# EAGLE design Main_board (EAGLE 7.2.0)

## Sheet 1 of 6: Stepstick
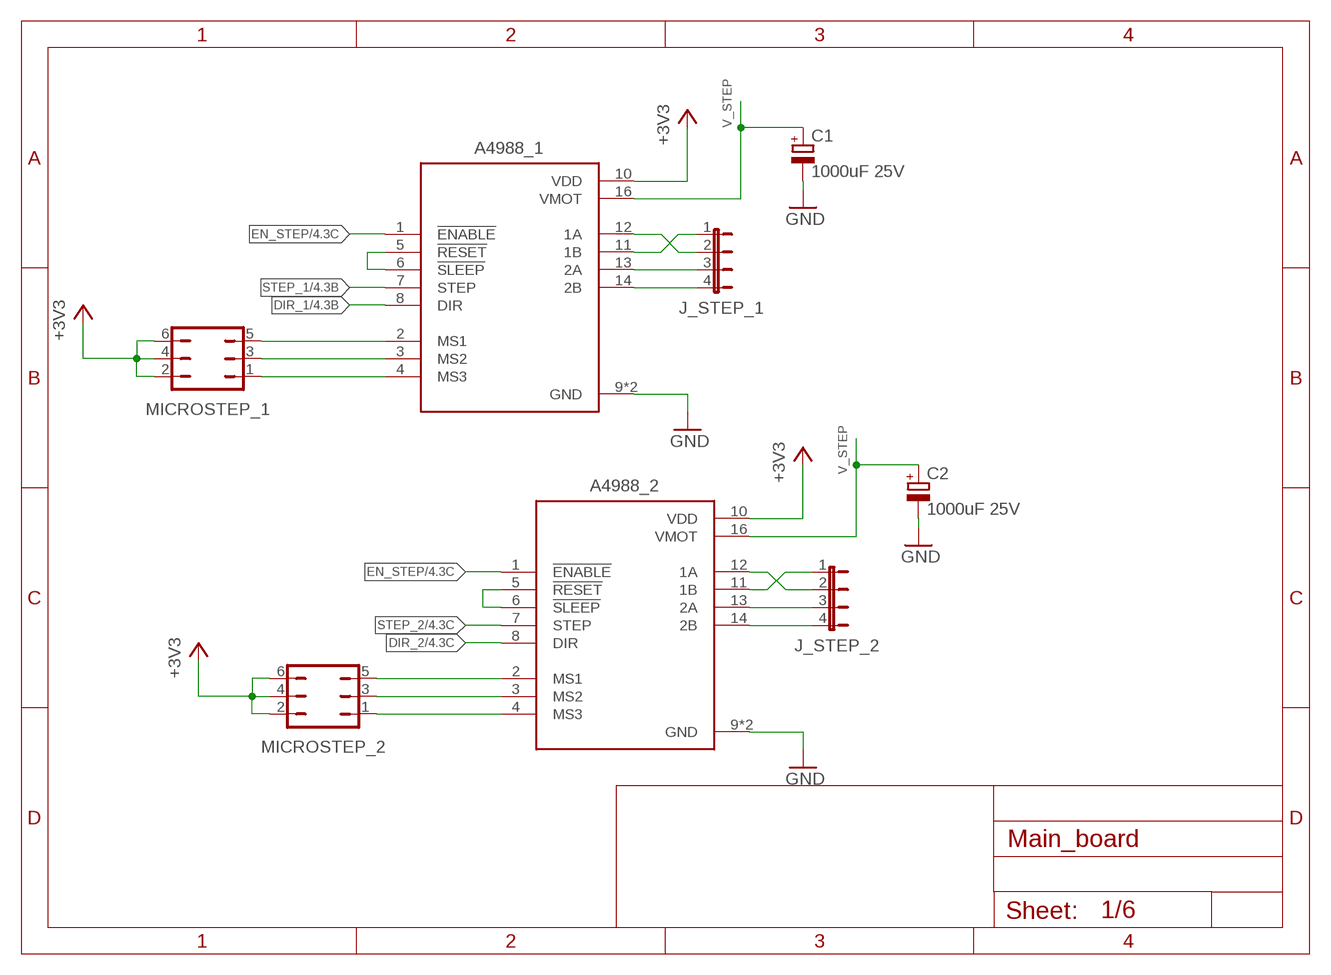
[diagram p0: schematic, sheet 1]

### Parts
A4988_1  A4988_STEPPER_MOTOR_DRIVER_CARRIER  [MODULE_A4988_STEPPER_MOTOR_DRIVER_CARRIER]
A4988_2  A4988_STEPPER_MOTOR_DRIVER_CARRIER  [MODULE_A4988_STEPPER_MOTOR_DRIVER_CARRIER]
C1  1000uF 25V  CPOL-EUE3.5-10  [E3,5-10]
C2  1000uF 25V  CPOL-EUE3.5-10  [E3,5-10]
J_STEP_1  JP4E  [JP4]
J_STEP_2  JP4E  [JP4]
MICROSTEP_1  JP3Q  [JP3Q]
MICROSTEP_2  JP3Q  [JP3Q]

### Nets
+3V3: A4988_1.10(VDD) A4988_2.10(VDD) MICROSTEP_1.2 MICROSTEP_1.4 MICROSTEP_1.6 MICROSTEP_2.2 MICROSTEP_2.4 MICROSTEP_2.6 ; also sheet 4,5,6
DIR_1: A4988_1.8(DIR) ; also sheet 4
DIR_2: A4988_2.8(DIR) ; also sheet 4
EN_STEP: A4988_1.1(!ENABLE) A4988_2.1(!ENABLE) ; also sheet 4
GND: A4988_1.9(GND) A4988_1.15(GND) A4988_2.9(GND) A4988_2.15(GND) C1.- C2.- ; also sheet 2,3,4,5,6
N$1: A4988_1.5(!RESET) A4988_1.6(!SLEEP)
N$2: A4988_1.2(MS1) MICROSTEP_1.5
N$3: A4988_1.3(MS2) MICROSTEP_1.3
N$4: A4988_1.4(MS3) MICROSTEP_1.1
N$5: A4988_1.11(1B) J_STEP_1.1
N$6: A4988_1.12(1A) J_STEP_1.2
N$7: A4988_1.13(2A) J_STEP_1.3
N$8: A4988_1.14(2B) J_STEP_1.4
N$9: A4988_2.2(MS1) MICROSTEP_2.5
N$10: A4988_2.3(MS2) MICROSTEP_2.3
N$11: A4988_2.4(MS3) MICROSTEP_2.1
N$12: A4988_2.5(!RESET) A4988_2.6(!SLEEP)
N$13: A4988_2.11(1B) J_STEP_2.1
N$14: A4988_2.12(1A) J_STEP_2.2
N$15: A4988_2.13(2A) J_STEP_2.3
N$16: A4988_2.14(2B) J_STEP_2.4
STEP_1: A4988_1.7(STEP) ; also sheet 4
STEP_2: A4988_2.7(STEP) ; also sheet 4
V_STEP: A4988_1.16(VMOT) A4988_2.16(VMOT) C1.+ C2.+ ; also sheet 6

## Sheet 2 of 6: Servo
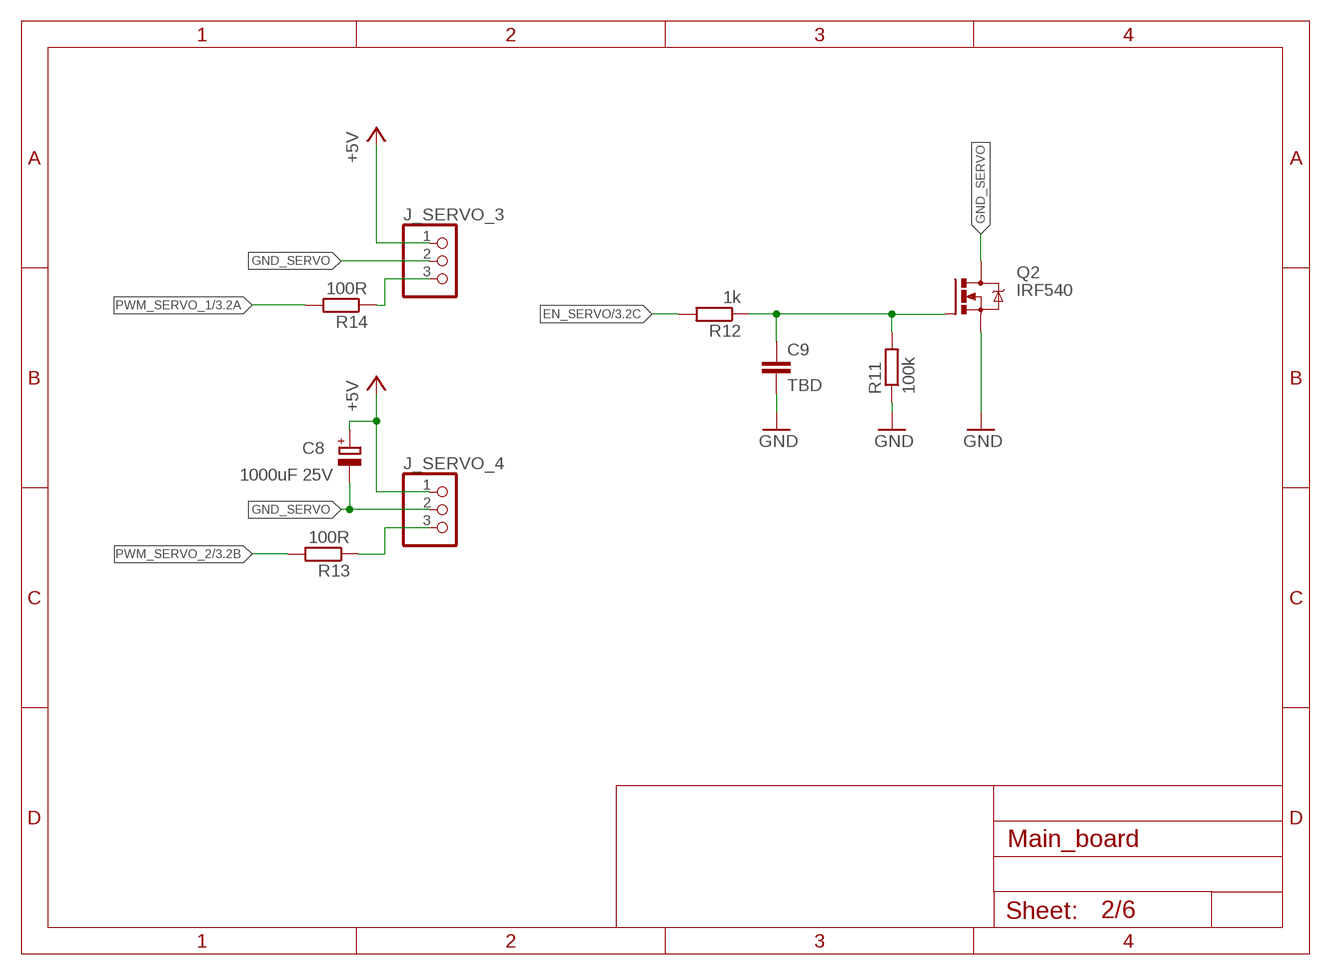
[diagram p1: schematic, sheet 2]

### Parts
C8  1000uF 25V  CPOL-EUE3.5-10  [E3,5-10]
C9  TBD  C-EUC3216  [C3216]
J_SERVO_3  PINHD-1X3  [1X03]
J_SERVO_4  PINHD-1X3  [1X03]
Q2  IRF540  [TO220BV]
R11  100k  R-EU_R3216  [R3216]
R12  1k  R-EU_R3216  [R3216]
R13  100R  R-EU_R3216  [R3216]
R14  100R  R-EU_R3216  [R3216]

### Nets
+5V: C8.+ J_SERVO_3.1 J_SERVO_4.1 ; also sheet 3,6
EN_SERVO: R12.2 ; also sheet 3
GND: C9.2 Q2.S R11.1 ; also sheet 1,3,4,5,6
GND_SERVO: C8.- J_SERVO_3.2 J_SERVO_4.2 Q2.D
N$21: C9.1 Q2.G R11.2 R12.1
N$22: J_SERVO_4.3 R13.1
N$23: J_SERVO_3.3 R14.1
PWM_SERVO_1: R14.2 ; also sheet 3
PWM_SERVO_2: R13.2 ; also sheet 3

## Sheet 3 of 6: Opamp
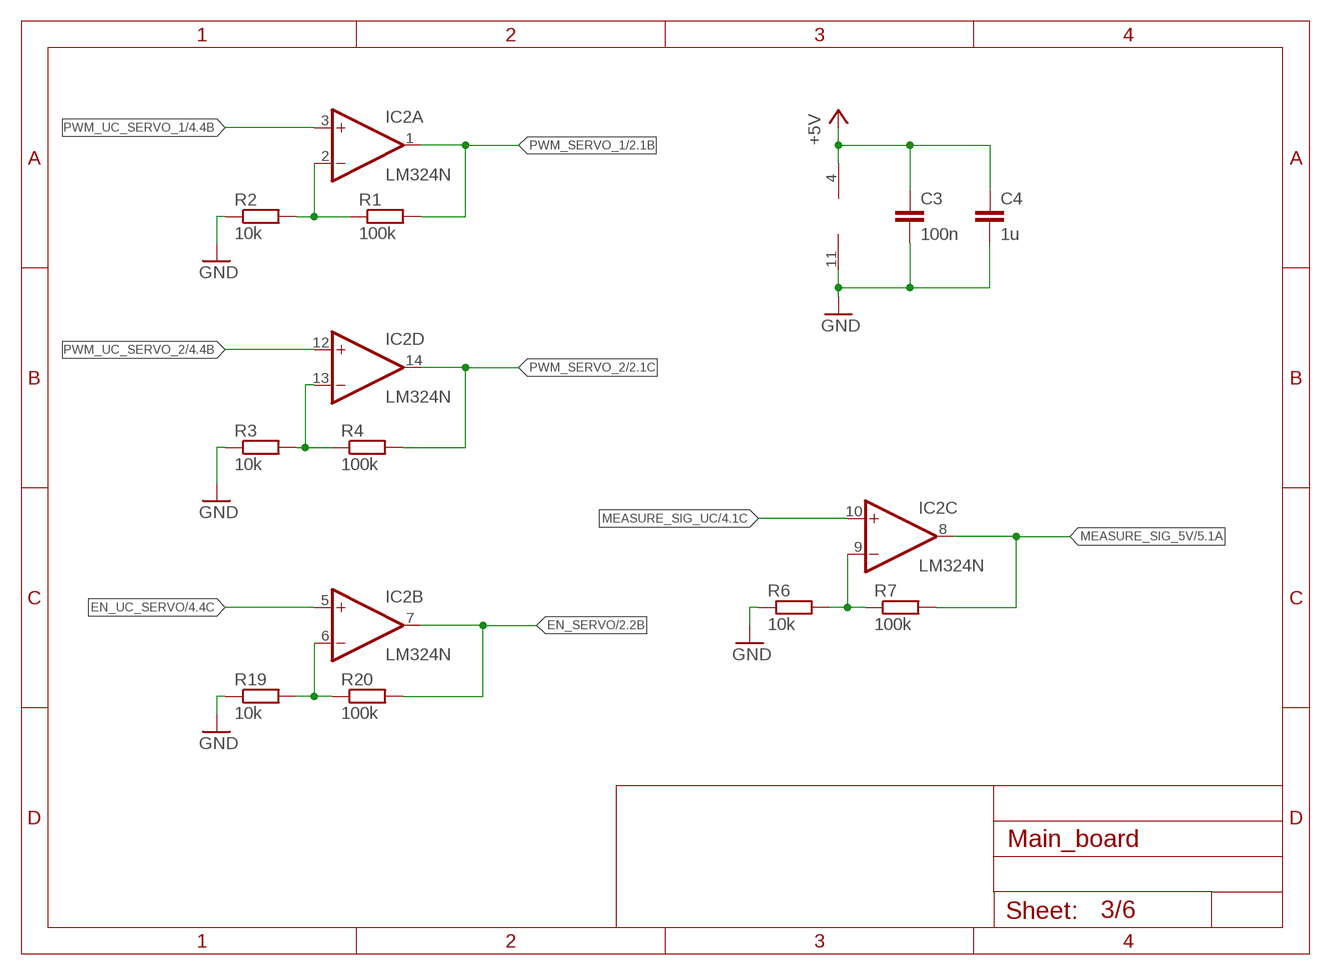
[diagram p2: schematic, sheet 3]

### Parts
C3  100n  C-EUC2012  [C2012]
C4  1u  C-EUC2012  [C2012]
IC2  LM324N  [DIL14]
R1  100k  R-EU_R3216  [R3216]
R2  10k  R-EU_R3216  [R3216]
R3  10k  R-EU_R3216  [R3216]
R4  100k  R-EU_R3216  [R3216]
R6  10k  R-EU_R3216  [R3216]
R7  100k  R-EU_R3216  [R3216]
R19  10k  R-EU_R3216  [R3216]
R20  100k  R-EU_R3216  [R3216]

### Nets
+5V: C3.1 C4.1 IC2.4(P:V+) ; also sheet 2,6
EN_SERVO: IC2.7(B:OUT) R20.2 ; also sheet 2
EN_UC_SERVO: IC2.5(B:+IN) ; also sheet 4
GND: C3.2 C4.2 IC2.11(P:V-) R2.1 R3.1 R6.1 R19.1 ; also sheet 1,2,4,5,6
MEASURE_SIG_5V: IC2.8(C:OUT) R7.2 ; also sheet 5
MEASURE_SIG_UC: IC2.10(C:+IN) ; also sheet 4,5
N$17: IC2.6(B:-IN) R19.2 R20.1
N$19: IC2.13(D:-IN) R3.2 R4.1
N$20: IC2.2(A:-IN) R1.1 R2.2
N$27: IC2.9(C:-IN) R6.2 R7.1
PWM_SERVO_1: IC2.1(A:OUT) R1.2 ; also sheet 2
PWM_SERVO_2: IC2.14(D:OUT) R4.2 ; also sheet 2
PWM_UC_SERVO_1: IC2.3(A:+IN) ; also sheet 4
PWM_UC_SERVO_2: IC2.12(D:+IN) ; also sheet 4

## Sheet 4 of 6: Stm32
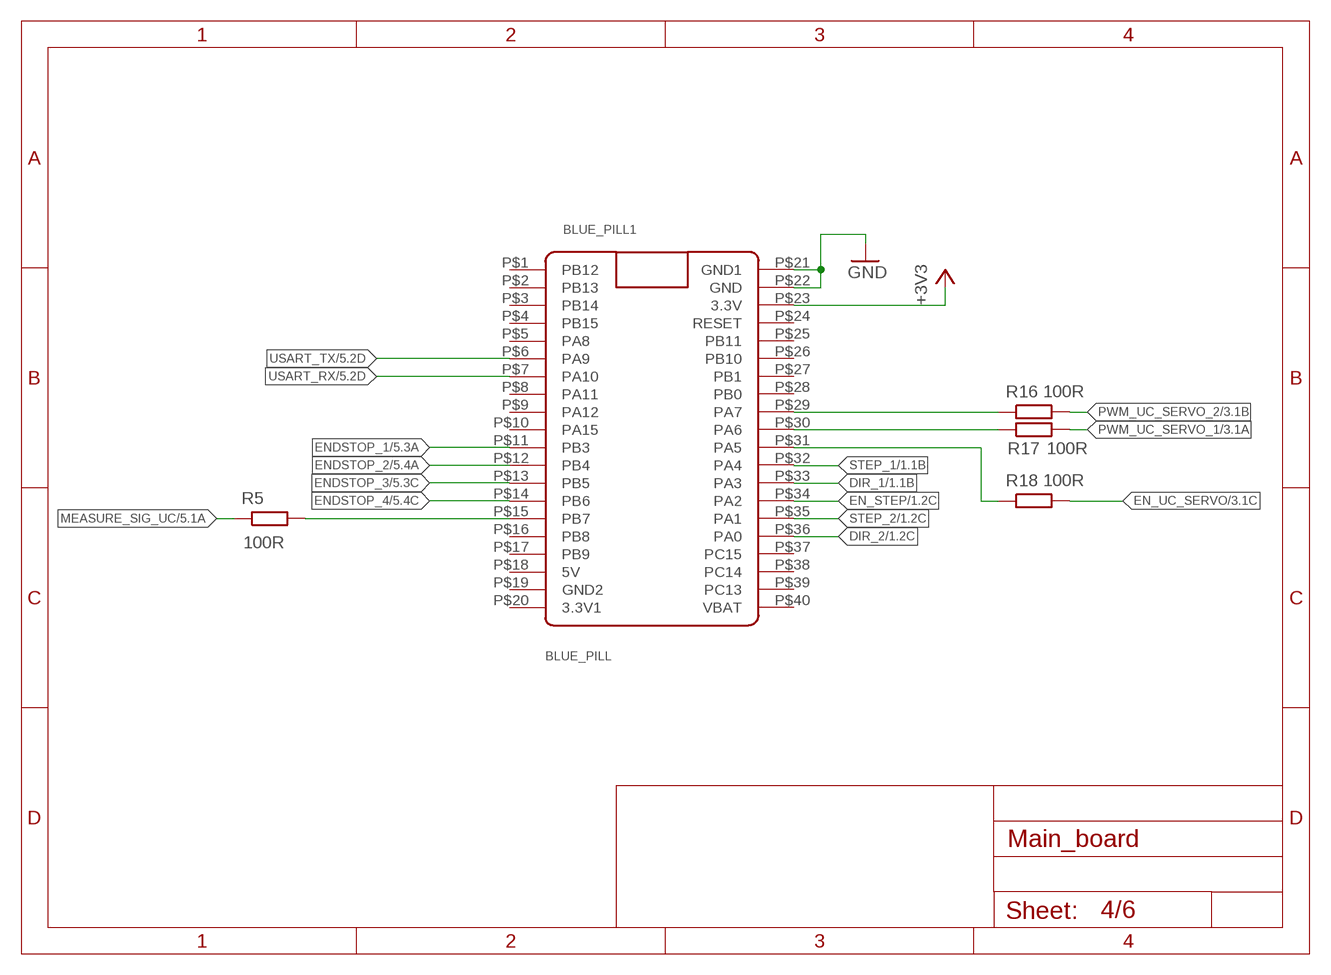
[diagram p3: schematic, sheet 4]

### Parts
BLUE_PILL1  BLUE_PILL  [BLUE_PILL]
R5  100R  R-EU_R3216  [R3216]
R16  100R  R-EU_R3216  [R3216]
R17  100R  R-EU_R3216  [R3216]
R18  100R  R-EU_R3216  [R3216]

### Nets
+3V3: BLUE_PILL1.P$23(3.3V) ; also sheet 1,5,6
DIR_1: BLUE_PILL1.P$33(PA3) ; also sheet 1
DIR_2: BLUE_PILL1.P$36(PA0) ; also sheet 1
EN_STEP: BLUE_PILL1.P$34(PA2) ; also sheet 1
EN_UC_SERVO: R18.2 ; also sheet 3
ENDSTOP_1: BLUE_PILL1.P$11(PB3) ; also sheet 5
ENDSTOP_2: BLUE_PILL1.P$12(PB4) ; also sheet 5
ENDSTOP_3: BLUE_PILL1.P$13(PB5) ; also sheet 5
ENDSTOP_4: BLUE_PILL1.P$14(PB6) ; also sheet 5
GND: BLUE_PILL1.P$21(GND1) BLUE_PILL1.P$22(GND) ; also sheet 1,2,3,5,6
MEASURE_SIG_UC: R5.1 ; also sheet 3,5
N$18: BLUE_PILL1.P$29(PA7) R16.1
N$24: BLUE_PILL1.P$31(PA5) R18.1
N$25: BLUE_PILL1.P$15(PB7) R5.2
N$26: BLUE_PILL1.P$30(PA6) R17.1
PWM_UC_SERVO_1: R17.2 ; also sheet 3
PWM_UC_SERVO_2: R16.2 ; also sheet 3
STEP_1: BLUE_PILL1.P$32(PA4) ; also sheet 1
STEP_2: BLUE_PILL1.P$35(PA1) ; also sheet 1
USART_RX: BLUE_PILL1.P$7(PA10) ; also sheet 5
USART_TX: BLUE_PILL1.P$6(PA9) ; also sheet 5
Unconnected: BLUE_PILL1.P$1(PB12) BLUE_PILL1.P$2(PB13) BLUE_PILL1.P$3(PB14) BLUE_PILL1.P$4(PB15) BLUE_PILL1.P$5(PA8) BLUE_PILL1.P$8(PA11) BLUE_PILL1.P$9(PA12) BLUE_PILL1.P$10(PA15) BLUE_PILL1.P$16(PB8) BLUE_PILL1.P$17(PB9) BLUE_PILL1.P$18(5V) BLUE_PILL1.P$19(GND2) BLUE_PILL1.P$20(3.3V1) BLUE_PILL1.P$24(RESET) BLUE_PILL1.P$25(PB11) BLUE_PILL1.P$26(PB10) BLUE_PILL1.P$27(PB1) BLUE_PILL1.P$28(PB0) BLUE_PILL1.P$37(PC15) BLUE_PILL1.P$38(PC14) BLUE_PILL1.P$39(PC13) BLUE_PILL1.P$40(VBAT)

## Sheet 5 of 6: UI
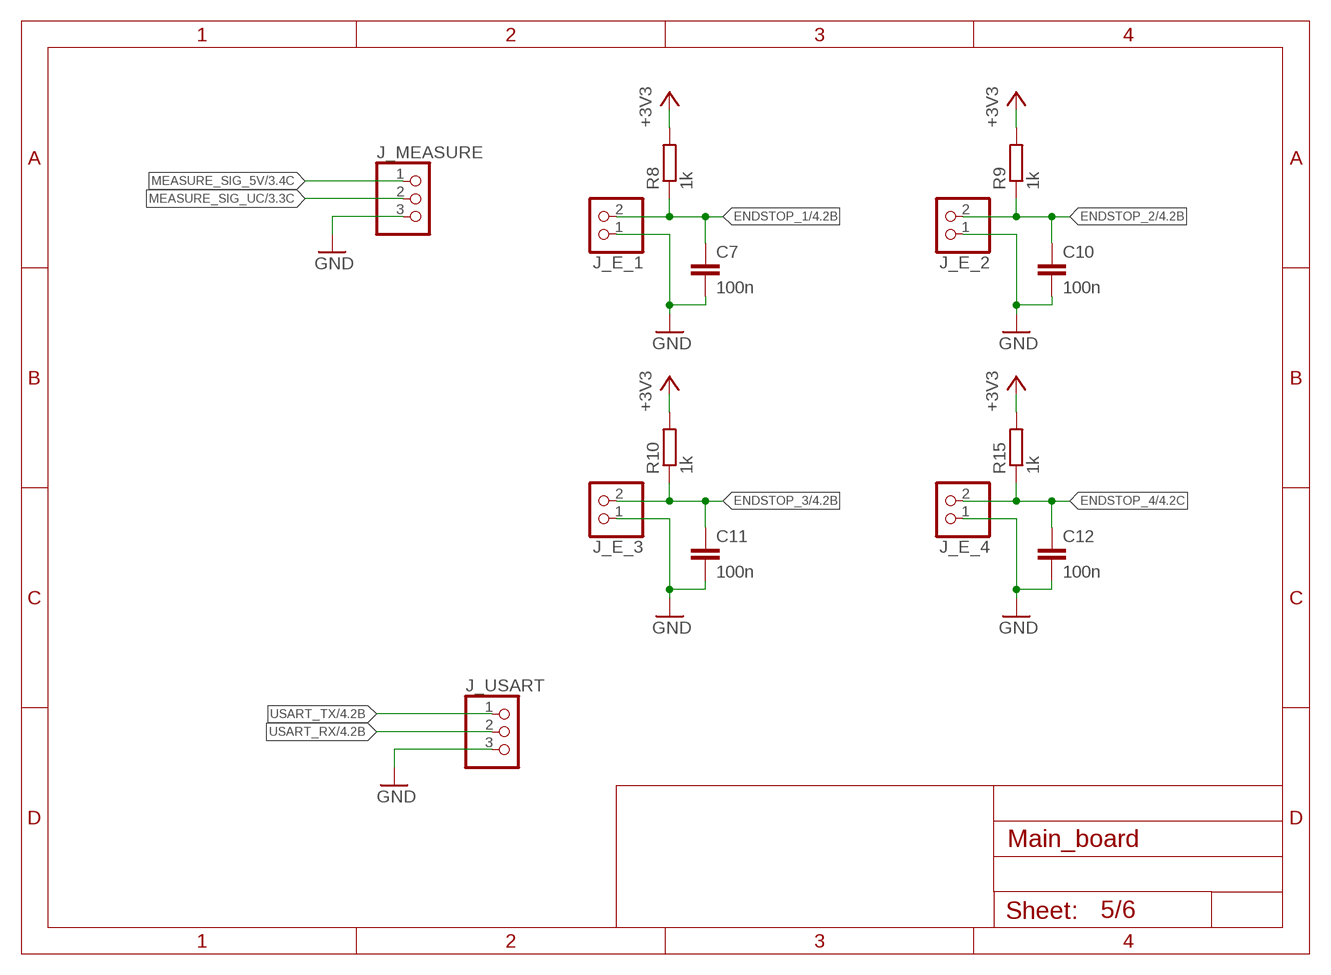
[diagram p4: schematic, sheet 5]

### Parts
C7  100n  C-EUC0402  [C0402]
C10  100n  C-EUC0402  [C0402]
C11  100n  C-EUC0402  [C0402]
C12  100n  C-EUC0402  [C0402]
J_E_1  PINHD-1X2  [1X02]
J_E_2  PINHD-1X2  [1X02]
J_E_3  PINHD-1X2  [1X02]
J_E_4  PINHD-1X2  [1X02]
J_MEASURE  PINHD-1X3  [1X03]
J_USART  PINHD-1X3  [1X03]
R8  1k  R-EU_R3216  [R3216]
R9  1k  R-EU_R3216  [R3216]
R10  1k  R-EU_R3216  [R3216]
R15  1k  R-EU_R3216  [R3216]

### Nets
+3V3: R8.2 R9.2 R10.2 R15.2 ; also sheet 1,4,6
ENDSTOP_1: C7.1 J_E_1.2 R8.1 ; also sheet 4
ENDSTOP_2: C10.1 J_E_2.2 R9.1 ; also sheet 4
ENDSTOP_3: C11.1 J_E_3.2 R10.1 ; also sheet 4
ENDSTOP_4: C12.1 J_E_4.2 R15.1 ; also sheet 4
GND: C7.2 C10.2 C11.2 C12.2 J_E_1.1 J_E_2.1 J_E_3.1 J_E_4.1 J_MEASURE.3 J_USART.3 ; also sheet 1,2,3,4,6
MEASURE_SIG_5V: J_MEASURE.1 ; also sheet 3
MEASURE_SIG_UC: J_MEASURE.2 ; also sheet 3,4
USART_RX: J_USART.2 ; also sheet 4
USART_TX: J_USART.1 ; also sheet 4

## Sheet 6 of 6: Power
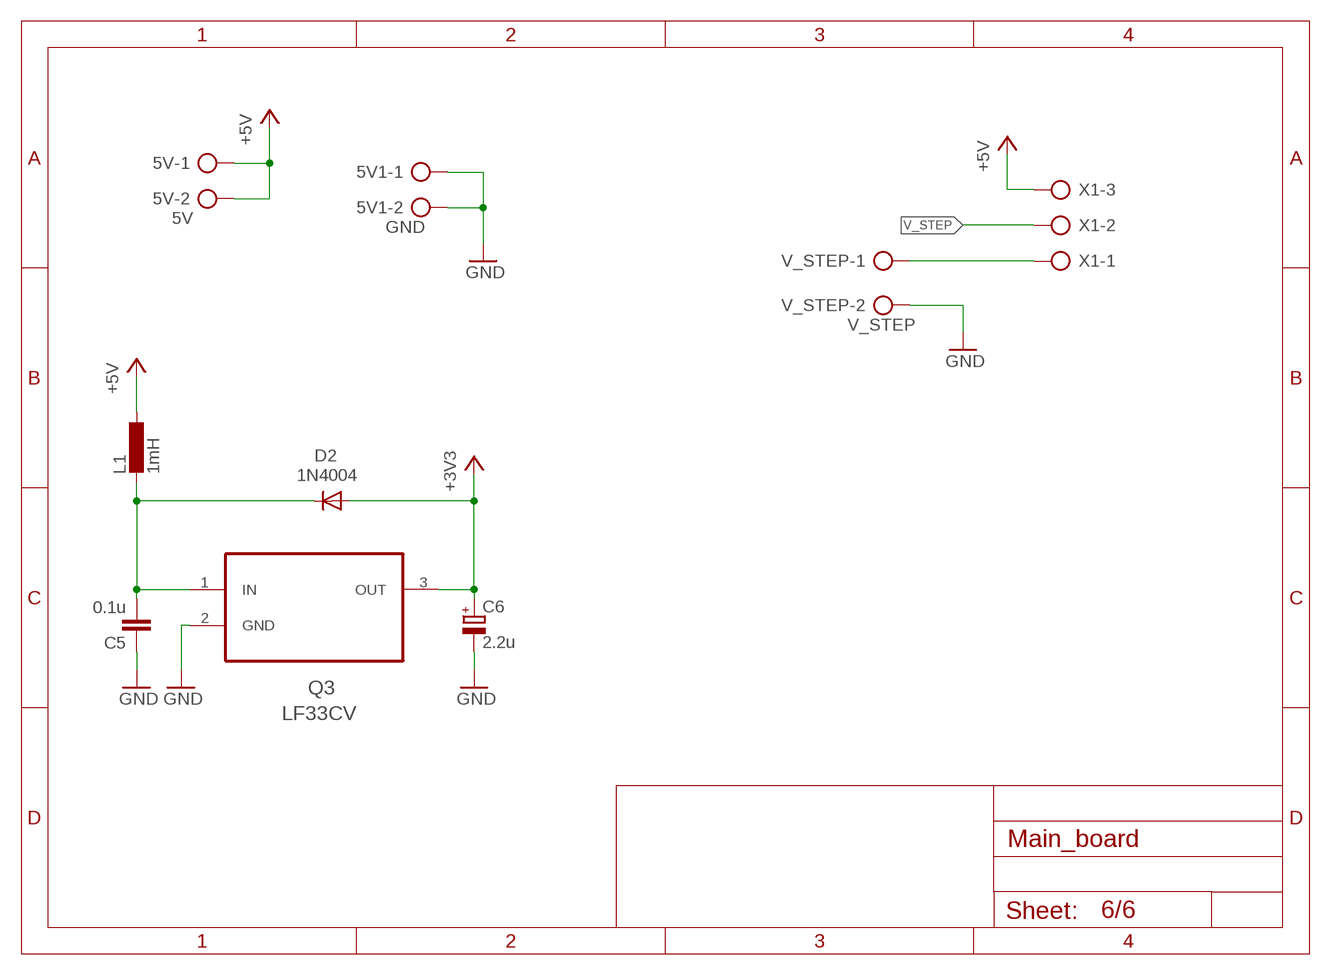
[diagram p5: schematic, sheet 6]

### Parts
5V  5V  AK500/2  [AK500/2]
5V1  GND  AK500/2  [AK500/2]
C5  0.1u  C-EUC3216  [C3216]
C6  2.2u  CPOL-EUE2.5-5  [E2,5-5]
D2  1N4004  [DO41-10]
L1  1mH  L-EUWE-TPC  [POWER-CHOKE_WE-TPC]
Q3  LF33CV  [TO254P450X1020X1935-3P]
V_STEP  V_STEP  AK500/2  [AK500/2]
X1  AK500/3-H  [AK500/3-H]

### Nets
+3V3: C6.+ D2.A Q3.3(OUT) ; also sheet 1,4,5
+5V: 5V.1 5V.2 L1.1 X1.3 ; also sheet 2,3
GND: 5V1.1 5V1.2 C5.1 C6.- Q3.2(GND) V_STEP.2 ; also sheet 1,2,3,4,5
N$28: V_STEP.1 X1.1
N$29: C5.2 D2.C L1.2 Q3.1(IN)
V_STEP: X1.2 ; also sheet 1

## Library data of the parts
5V 5V1 V_STEP = con-ptr500:AK500/2: CONNECTOR; OC_FARNELL: unknown; OC_NEWARK: unknown
A4988_1 A4988_2 = A4988_STEPPER_MOTOR_DRIVER_CARRIER:A4988_STEPPER_MOTOR_DRIVER_CARRIER: Stepper motor controler; IC: A4988; 1A; Uin mot: 8÷35V Check prices <https://pricing.snapeda.com/parts/A4988%20STEPPER%20MOTOR%20DRIVER%20CARRIER/Pololu/view-part?ref=eda>; AVAILABILITY: Not in stock; DESCRIPTION: Stepper Motor Driver; MF: Pololu; MP: A4988 STEPPER MOTOR DRIVER CARRIER; PACKAGE: None; PRICE: None
BLUE_PILL1 = BluePill:BLUE_PILL
C1 C2 C6 C8 = rcl:CPOL-EU: POLARIZED CAPACITOR, European symbol
C3-C5 C7 C9-C12 = rcl:C-EU: CAPACITOR, European symbol
D2 = diode:1N4004: DIODE general purpose rectifier, 1 A
IC2 = linear:LM324: OP AMP
J_E_1-J_E_4 = pinhead:PINHD-1X2: PIN HEADER
J_MEASURE J_SERVO_3 J_SERVO_4 J_USART = pinhead:PINHD-1X3: PIN HEADER
J_STEP_1 J_STEP_2 = jumper:JP4E: JUMPER
L1 = rcl:L-EU: INDUCTOR, European symbol
MICROSTEP_1 MICROSTEP_2 = jumper:JP3Q: JUMPER
Q2 = transistor-power:IRF540: HEXFET Power MOSFET
Q3 = LF33CV:LF33CV: Very low drop voltage regulators with inhibit Check prices <https://pricing.snapeda.com/parts/LF33CV/STMicroelectronics/view-part?ref=eda>; AVAILABILITY: In Stock; DESCRIPTION: Linear Voltage Regulator IC Positive Fixed 1 Output 500mA TO-220; MF: STMicroelectronics; MP: LF33CV; PACKAGE: TO-220-3 ON Semiconductor; PRICE: None; PURCHASE-URL: https://pricing.snapeda.com/search/part/LF33CV/?ref=eda
R1-R20 = rcl:R-EU_: RESISTOR, European symbol
X1 = con-ptr500:AK500/3-H: CONNECTOR Aug. 2004 / PTR Meßtechnik: Die Bezeichnung der Serie AK505 wurde geändert. Es handelt sich hierbei um AK500 in horizontaler Ausführung.; OC_FARNELL: unknown; OC_NEWARK: unknown

## Board
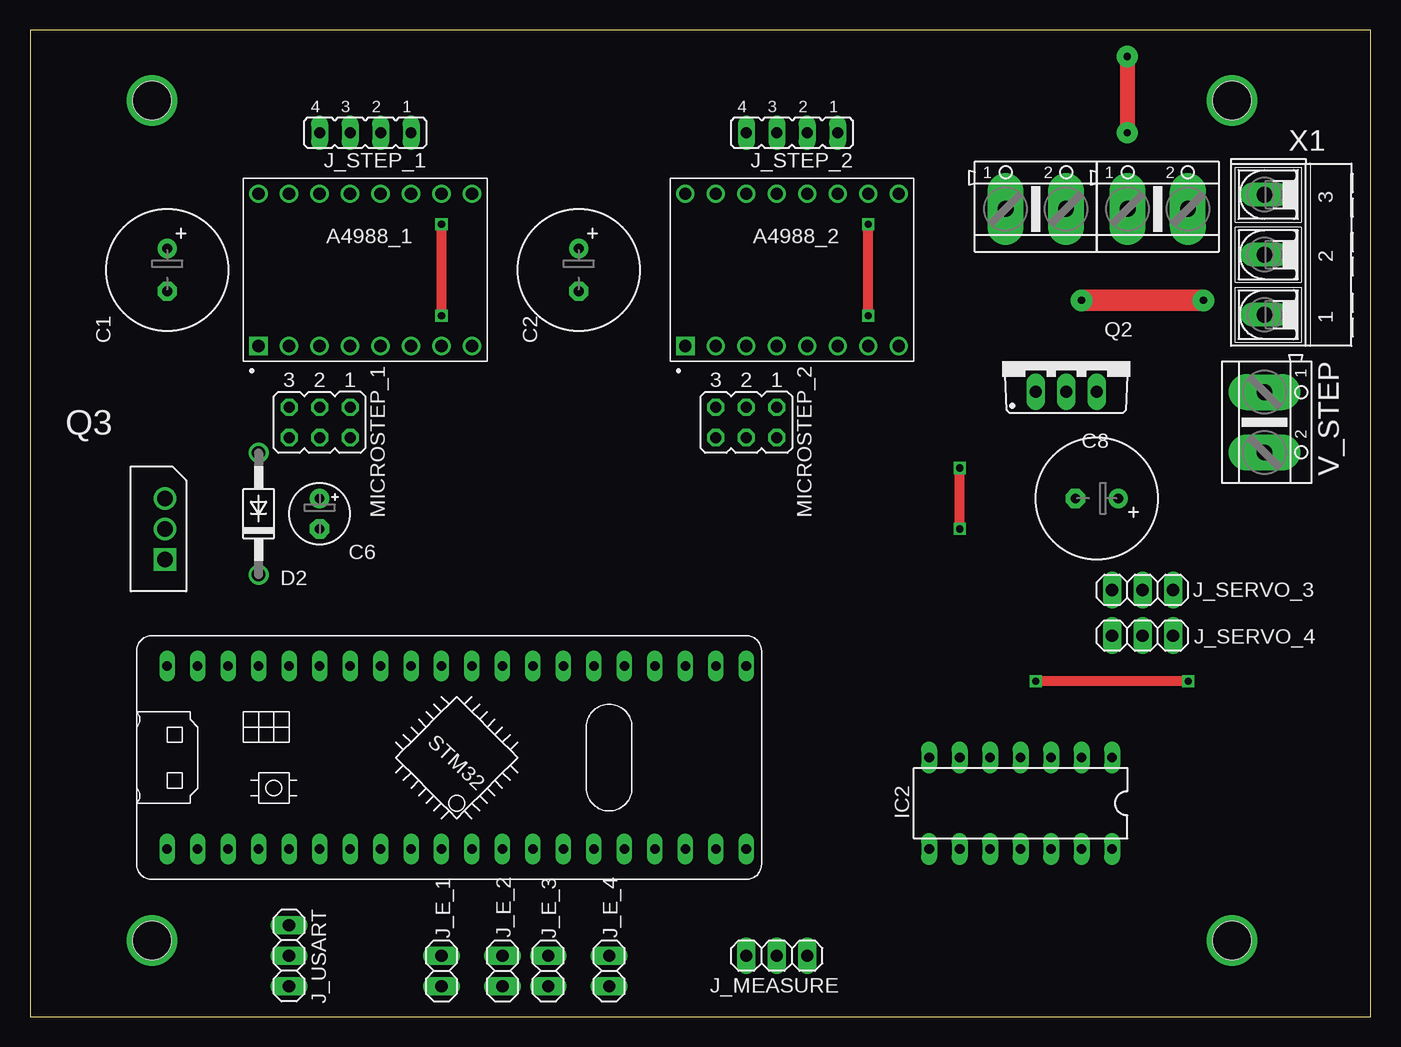
[diagram p6: board, top side]
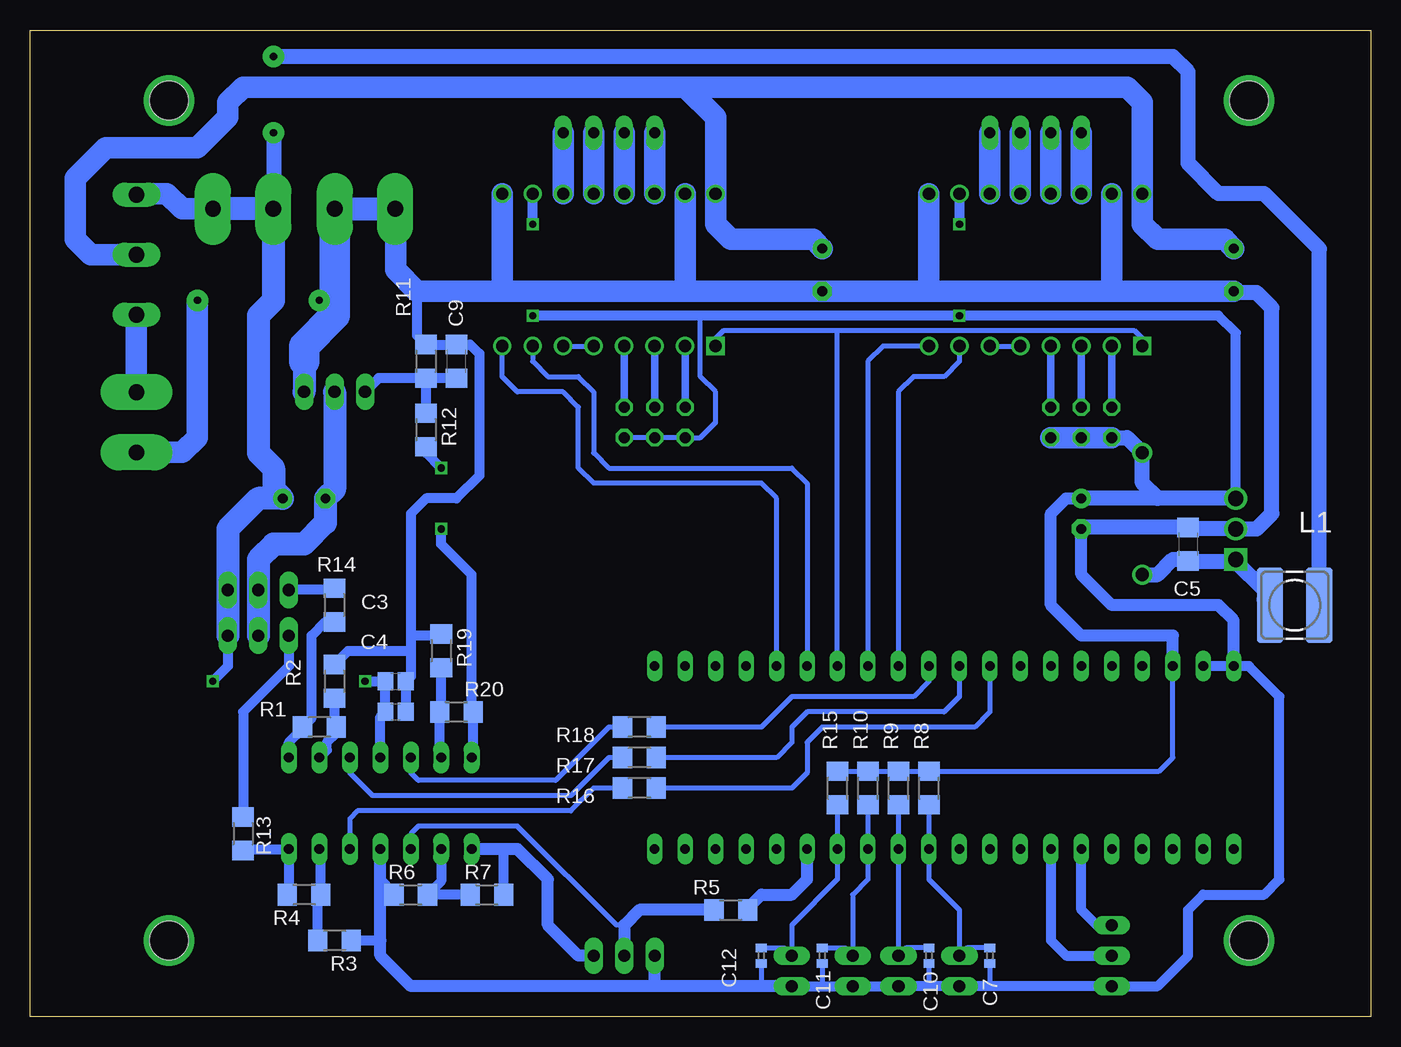
[diagram p7: board, bottom side, seen from below]

Size 111.74 x 82.22 mm. Coordinates in mm from the lower left corner, seen from the top.
Outline: 0,0 111.74,0 111.74,82.22 0,82.22 0,0
Copper layers (1*16): Top 0.035mm / dielectric 1.5mm / Bottom 0.035mm
Design rules "default": minimum track width 10mil, minimum drill 24mil, track to track 8mil, track to pad 8mil, pad to pad 8mil, via to via 8mil, smd to smd 8mil, copper to edge 40mil, drill to drill 8mil, minimum pad ring 10mil, minimum via ring 8mil, stop-mask expansion 4mil, vias tented up to drill 0mil, thermal gap 10mil
Holes 3.2 mm at 100.16,6.35 10.16,6.35 10.16,76.35 100.16,76.35

### Footprints (pad centres in the part's own frame; a part is rotated, then mirrored left to right if it is on the bottom)
AK500/2 = drill 1.321 pad 3 long: 1 -2.515,0; 2 2.515,0
MODULE_A4988_STEPPER_MOTOR_DRIVER_CARRIER = drill 1.02 square: 1 -6.35,8.89 | drill 1.02: 2 -6.35,6.35; 3 -6.35,3.81; 4 -6.35,1.27; 5 -6.35,-1.27; 6 -6.35,-3.81; 7 -6.35,-6.35; 8 -6.35,-8.89; 9 6.35,-8.89; 10 6.35,-6.35; 11 6.35,-3.81; 12 6.35,-1.27; 13 6.35,1.27; 14 6.35,3.81; 15 6.35,6.35; 16 6.35,8.89
BLUE_PILL = drill 0.8 long: P$1 -7.62,15.24; P$2 -7.62,12.7; P$3 -7.62,10.16; P$4 -7.62,7.62; P$5 -7.62,5.08; P$6 -7.62,2.54; P$7 -7.62,0; P$8 -7.62,-2.54; P$9 -7.62,-5.08; P$10 -7.62,-7.62; P$11 -7.62,-10.16; P$12 -7.62,-12.7; P$13 -7.62,-15.24; P$14 -7.62,-17.78; P$15 -7.62,-20.32; P$16 -7.62,-22.86; P$17 -7.62,-25.4; P$18 -7.62,-27.94; P$19 -7.62,-30.48; P$20 -7.62,-33.02; P$21 7.62,15.24; P$22 7.62,12.7; P$23 7.62,10.16; P$24 7.62,7.62; P$25 7.62,5.08; P$26 7.62,2.54; P$27 7.62,0; P$28 7.62,-2.54; P$29 7.62,-5.08; P$30 7.62,-7.62; P$31 7.62,-10.16; P$32 7.62,-12.7; P$33 7.62,-15.24; P$34 7.62,-17.78; P$35 7.62,-20.32; P$36 7.62,-22.86; P$37 7.62,-25.4; P$38 7.62,-27.94; P$39 7.62,-30.48; P$40 7.62,-33.02
E3,5-10 = drill 0.813 pad 1.6: + -1.778,0 | drill 0.813 pad 1.6 octagon: - 1.778,0
C2012 = smd 1.3 x 1.5: 1 -0.85,0; 2 0.85,0
C3216 = smd 1.6 x 1.8: 1 -1.4,0; 2 1.4,0
E2,5-5 = drill 0.813 pad 1.6: + -1.27,0 | drill 0.813 pad 1.6 octagon: - 1.27,0
C0402 = smd 0.7 x 0.9: 1 -0.65,0; 2 0.65,0
DO41-10 = drill 1.118: A 5.08,0; C -5.08,0
DIL14 = drill 0.813 long: 1 -7.62,-3.81; 2 -5.08,-3.81; 3 -2.54,-3.81; 4 0,-3.81; 5 2.54,-3.81; 6 5.08,-3.81; 7 7.62,-3.81; 8 7.62,3.81; 9 5.08,3.81; 10 2.54,3.81; 11 0,3.81; 12 -2.54,3.81; 13 -5.08,3.81; 14 -7.62,3.81
1X02 = drill 1.016 long: 1 -1.27,0; 2 1.27,0
1X03 = drill 1.016 long: 1 -2.54,0; 2 0,0; 3 2.54,0
JP4 = drill 0.914 long: 1 -3.81,0; 2 -1.27,0; 3 1.27,0; 4 3.81,0
POWER-CHOKE_WE-TPC = smd 6.3 x 2.2: 1 0,2.05; 2 0,-2.05
JP3Q = drill 0.914 octagon: 1 -2.54,-1.27; 2 -2.54,1.27; 3 0,-1.27; 4 0,1.27; 5 2.54,-1.27; 6 2.54,1.27
TO220BV = drill 1.016 long: D 0,-2.54; G -2.54,-2.54; S 2.54,-2.54
TO254P450X1020X1935-3P = drill 1.27 square: 1 -5.08,-1.092 | drill 1.27: 2 -2.54,-1.092; 3 0,-1.092
R3216 = smd 1.6 x 1.8: 1 -1.4,0; 2 1.4,0
AK500/3-H = drill 1.321 long: 1 -5.004,0; 2 0,0; 3 5.004,0

### Placement (x,y rotation side)
5V  93.98,67.31 0 top
5V1  83.82,67.31 0 top
A4988_1  27.94,62.23 90 top
A4988_2  63.5,62.23 90 top
BLUE_PILL1  26.67,21.59 90 top
C1  11.43,62.23 270 top
C2  45.72,62.23 270 top
C3  81.28,27.94 0 bottom
C4  81.28,25.4 0 bottom
C5  15.24,39.37 270 bottom
C6  24.13,41.91 270 top
C7  31.75,5.08 270 bottom
C8  88.9,43.18 180 top
C9  76.2,54.61 90 bottom
C10  36.83,5.08 270 bottom
C11  45.72,5.08 270 bottom
C12  50.8,5.08 270 bottom
D2  19.05,41.91 90 top
IC2  82.55,17.78 180 top
J_E_1  34.29,3.81 90 top
J_E_2  39.37,3.81 90 top
J_E_3  43.18,3.81 90 top
J_E_4  48.26,3.81 90 top
J_MEASURE  62.23,5.08 180 top
J_SERVO_3  92.71,35.56 180 top
J_SERVO_4  92.71,31.75 180 top
J_STEP_1  27.94,73.66 180 top
J_STEP_2  63.5,73.66 180 top
J_USART  21.59,5.08 270 top
L1  6.35,34.29 270 bottom
MICROSTEP_1  24.13,49.53 180 top
MICROSTEP_2  59.69,49.53 180 top
Q2  86.36,54.61 0 top
Q3  10.16,43.18 90 top
R1  87.63,24.13 180 bottom
R2  86.36,27.94 270 bottom
R3  86.36,6.35 180 bottom
R4  88.9,10.16 180 bottom
R5  53.34,8.89 0 bottom
R6  80.01,10.16 0 bottom
R7  73.66,10.16 0 bottom
R8  36.83,19.05 90 bottom
R9  39.37,19.05 90 bottom
R10  41.91,19.05 90 bottom
R11  78.74,54.61 270 bottom
R12  78.74,48.9 270 bottom
R13  93.98,15.24 270 bottom
R14  86.36,34.29 270 bottom
R15  44.45,19.05 90 bottom
R16  60.96,19.05 180 bottom
R17  60.96,21.59 180 bottom
R18  60.96,24.13 180 bottom
R19  77.47,30.48 270 bottom
R20  76.2,25.4 0 bottom
V_STEP  102.87,49.53 270 top
X1  102.87,63.5 90 top

### Tracks (layer width: path | path; a pad name or v marks a point on that pad's centre or on a via)
+3V3  (via drill 0.6)
  Top 0.813: v69.85,58.42 v69.85,66.04 | v34.29,66.04 v34.29,58.42
  Bottom 0.406: MICROSTEP_2.2 MICROSTEP_2.4 MICROSTEP_2.6 55.88,48.26 54.61,49.53 54.61,52.07 55.88,53.34 55.88,58.42 | R15.2 R10.2 R9.2 R8.2 17.65,20.45 16.51,21.59 BLUE_PILL1.P$23
  Bottom 0.813: Q3.3 11.25,56.97 12.7,58.42 v34.29,58.42 55.88,58.42 v69.85,58.42 | v69.85,66.04 A4988_2.10 | A4988_1.10 v34.29,66.04
  Bottom 1.016: BLUE_PILL1.P$23 16.51,31.75 24.13,31.75 26.67,34.29 26.67,41.91 25.4,43.18 C6.+
  Bottom 1.27: C6.+ Q3.3 17.78,43.18 19.05,44.45 D2.A 20.32,48.26 MICROSTEP_1.6
  Bottom 1.778: MICROSTEP_1.6 MICROSTEP_1.4 MICROSTEP_1.2
+5V  (via drill 0.6, 0.6 pad 1.78)
  Top 0.813: v96.52,27.94 v83.82,27.94
  Top 1.27: v91.44,80.01 v91.44,73.66
  Bottom 0.813: IC2.4 82.55,24.98 C4.1 C3.1 v83.82,27.94 | J_SERVO_4.1 95.25,29.21 v96.52,27.94
  Bottom 1.27: L1.1 4.3,63.99 8.89,68.58 12.7,68.58 15.24,71.12 15.24,78.74 16.51,80.01 v91.44,80.01 | v91.44,73.66 91.44,67.33
  Bottom 1.778: 91.44,67.33 5V.1 | 5V.2 99.06,67.31 100.33,68.58 102.79,68.58 X1.3
  Bottom 1.93: 5V.2 5V.1 91.47,59.66 92.71,58.42 92.71,46.99 91.44,45.72 91.44,43.94 C8.+ 92.71,43.18 95.25,40.64 J_SERVO_3.1 J_SERVO_4.1
DIR_1
  Bottom 0.406: A4988_1.8 40.64,55.88 41.91,54.61 BLUE_PILL1.P$33
DIR_2
  Bottom 0.406: BLUE_PILL1.P$36 49.53,43.18 50.8,44.45 64.77,44.45 66.04,45.72 66.04,50.8 67.31,52.07 71.12,52.07 72.39,53.34 A4988_2.8
EN_SERVO  (via drill 0.6)
  Top 0.813: v77.47,40.64 v77.47,45.72
  Bottom 0.813: IC2.7 74.8,21.72 R20.2 74.93,25.53 74.93,36.83 77.47,39.37 v77.47,40.64 | v77.47,45.72 78.74,46.99 R12.2
EN_STEP
  Bottom 0.406: A4988_1.1 19.05,56.52 19.69,57.15 44.45,57.15 | 44.45,57.15 53.97,57.15 54.61,56.52 A4988_2.1 | BLUE_PILL1.P$34 44.45,57.15
EN_UC_SERVO
  Bottom 0.406: R18.2 63.5,24.13 67.94,19.69 79.38,19.69 80.01,20.32 IC2.5
ENDSTOP_1
  Bottom 0.406: C7.1 33.64,5.73 J_E_1.2 34.29,8.89 36.83,11.43 BLUE_PILL1.P$11 R8.1
ENDSTOP_2
  Bottom 0.406: C10.1 38.72,5.73 J_E_2.2 BLUE_PILL1.P$12 R9.1
ENDSTOP_3
  Bottom 0.406: C11.1 43.83,5.73 J_E_3.2 43.18,10.16 41.91,11.43 BLUE_PILL1.P$13 R10.1
ENDSTOP_4
  Bottom 0.406: C12.1 48.91,5.73 J_E_4.2 48.26,7.62 44.45,11.43 BLUE_PILL1.P$14 R15.1
GND  (via drill 0.6 pad 1.78)
  Top 1.778: v97.79,59.69 v87.63,59.69
  Bottom 0.406: C7.2 31.75,2.54 | C10.2 36.83,2.54 | C11.2 45.72,2.54 | C12.2 50.8,2.54
  Bottom 0.813: J_E_4.1 45.72,2.54 J_E_3.1 J_E_2.1 36.83,2.54 J_E_1.1 31.75,2.54 J_USART.3 17.78,2.54 15.24,5.08 15.24,8.89 13.97,10.16 8.89,10.16 7.62,11.43 7.62,26.67 10.16,29.21 BLUE_PILL1.P$21 BLUE_PILL1.P$22 | R6.1 81.41,10.29 82.55,11.43 IC2.11 | 79.5,60.45 79.5,56.77 R11.1 C9.2 75.06,56.01 74.3,55.25 74.3,45.09 76.2,43.18 78.74,43.18 80.01,41.91 80.01,31.75 | R3.1 82.55,6.35 | 80.01,31.75 80.01,30.48 | 80.01,30.48 80.01,28.36 C3.2 C4.2 | R2.1 85.22,30.48 80.01,30.48 | R19.1 77.6,31.75 80.01,31.75
  Bottom 1.016: BLUE_PILL1.P$21 11.43,33.02 12.7,34.29 21.59,34.29 24.13,36.83 C6.- | J_E_4.1 50.8,2.54 59.69,2.54 | 59.69,2.54 J_MEASURE.3 | 59.69,2.54 80.01,2.54 82.55,5.08 82.55,6.35 IC2.11
  Bottom 1.27: C6.- 24,40.77 C5.1 15.11,40.64 Q3.2 9.53,40.64 8.26,41.91 8.26,59.05 9.53,60.33 11.3,60.33 C1.-
  Bottom 1.778: 57.15,60.45 C2.- 36.83,60.45 | 57.15,60.45 72.39,60.45 | 72.39,60.45 79.5,60.45 81.28,62.23 81.28,67.28 5V1.1 | A4988_2.9 72.39,60.45 | A4988_2.15 57.15,60.45 | C1.- 21.59,60.45 | 21.59,60.45 36.83,60.45 | A4988_1.9 36.83,60.45 | A4988_1.15 21.59,60.45 | V_STEP.2 99.03,47.02 97.79,48.26 v97.79,59.69 | v87.63,59.69 86.33,59.69
  Bottom 1.93: 88.9,54.61 Q2.S | 5V1.2 5V1.1
  Bottom 2.54: 5V1.2 86.33,59.69 86.33,58.45 88.9,55.88 88.9,54.61
GND_SERVO
  Bottom 1.93: Q2.D 86.36,43.94 C8.- 87.12,41.15 88.9,39.37 91.44,39.37 92.71,38.1 J_SERVO_3.2 J_SERVO_4.2
MEASURE_SIG_5V
  Bottom 0.813: R7.2 72.26,13.84 72.39,13.97
  Bottom 1.016: J_MEASURE.1 66.04,5.08 68.58,7.62 68.58,11.43 71.12,13.97 72.39,13.97 IC2.8
MEASURE_SIG_UC
  Bottom 0.406: IC2.10 80.01,15.24 79.38,15.88 71.12,15.88 62.86,7.62 62.23,7.62
  Bottom 1.016: R5.1 60.96,8.89 62.23,7.62 J_MEASURE.2
N$1
  Bottom 0.406: A4988_1.6 A4988_1.5
N$2
  Bottom 0.61: MICROSTEP_1.5 A4988_1.2
N$3
  Bottom 0.61: A4988_1.3 MICROSTEP_1.3
N$4
  Bottom 0.61: A4988_1.4 MICROSTEP_1.1
N$5
  Bottom 1.778: J_STEP_1.1 A4988_1.11
N$6
  Bottom 1.778: J_STEP_1.2 A4988_1.12
N$7
  Bottom 1.778: J_STEP_1.3 A4988_1.13
N$8
  Bottom 1.778: J_STEP_1.4 A4988_1.14
N$9
  Bottom 0.61: A4988_2.2 MICROSTEP_2.5
N$10
  Bottom 0.61: A4988_2.3 MICROSTEP_2.3
N$11
  Bottom 0.61: A4988_2.4 MICROSTEP_2.1
N$12
  Bottom 0.406: A4988_2.6 A4988_2.5
N$13
  Bottom 1.778: J_STEP_2.1 A4988_2.11
N$14
  Bottom 1.778: J_STEP_2.2 A4988_2.12
N$15
  Bottom 1.778: J_STEP_2.3 A4988_2.13
N$16
  Bottom 1.778: J_STEP_2.4 A4988_2.14
N$17
  Bottom 0.813: IC2.6 77.6,21.72 R20.1 77.47,25.53 R19.2
N$18
  Bottom 0.406: BLUE_PILL1.P$29 31.75,25.4 33.02,24.13 45.72,24.13 46.99,22.86 46.99,20.32 48.26,19.05 R16.1
N$19
  Bottom 0.813: IC2.13 87.5,13.84 R4.1 87.76,9.9 R3.2
N$20
  Bottom 0.813: IC2.2 86.99,22.23 86.99,22.86 86.23,23.62 R1.1 86.36,24.26 R2.2
N$21
  Bottom 0.813: C9.1 R11.2 | R11.2 82.68,53.21 Q2.G | R12.1 R11.2
N$22
  Bottom 0.813: J_SERVO_4.3 90.17,29.21 93.98,25.4 R13.1
N$23
  Bottom 0.813: R14.1 86.49,35.56 J_SERVO_3.3
N$24
  Bottom 0.406: BLUE_PILL1.P$31 36.83,27.94 38.1,26.67 48.26,26.67 50.8,24.13 R18.1
N$25
  Bottom 1.016: R5.2 51.94,9.02 50.8,10.16 48.26,10.16 46.99,11.43 BLUE_PILL1.P$15
N$26
  Bottom 0.406: BLUE_PILL1.P$30 34.29,26.67 35.56,25.4 46.99,25.4 48.26,24.13 48.26,22.86 49.53,21.59 R17.1 59.69,21.59
N$27
  Bottom 0.813: IC2.9 77.47,11.3 R6.2 R7.1
N$28
  Bottom 1.778: X1.1 V_STEP.1
N$29
  Bottom 1.27: D2.C 17.78,36.83 16.51,38.1 15.37,38.1 C5.2 11.38,37.97 Q3.1 11.25,37.92 8.89,35.56 8.89,34.78 L1.2
N$30  (via drill 3.2)
  other vias: 10.16,6.35
N$31  (via drill 3.2)
  other vias: 10.16,76.35
N$32  (via drill 3.2)
  other vias: 100.16,76.35
N$33  (via drill 3.2)
  other vias: 100.16,6.35
PWM_SERVO_1
  Bottom 0.813: IC2.1 90.17,22.86 89.03,24 R1.2 88.27,24.9 88.27,31.75 87.12,32.89 R14.2
PWM_SERVO_2
  Bottom 0.813: R4.2 90.17,10.29 IC2.14 93.85,13.97 R13.2
PWM_UC_SERVO_1
  Bottom 0.406: R17.2 63.5,21.59 66.67,18.41 83.19,18.41 85.09,20.32 IC2.3
PWM_UC_SERVO_2
  Bottom 0.406: R16.2 64.77,19.05 66.67,17.14 84.45,17.14 85.09,16.51 IC2.12
STEP_1
  Bottom 0.406: A4988_1.7 34.29,54.61 35.56,53.34 38.1,53.34 39.37,52.07 BLUE_PILL1.P$32
STEP_2
  Bottom 0.406: A4988_2.7 69.85,54.61 68.58,53.34 66.04,53.34 64.77,52.07 64.77,46.99 63.5,45.72 48.26,45.72 46.99,44.45 BLUE_PILL1.P$35
USART_RX
  Bottom 0.813: BLUE_PILL1.P$7 26.67,6.35 25.4,5.08 J_USART.2
USART_TX
  Bottom 0.813: J_USART.1 22.86,7.62 24.13,8.89 BLUE_PILL1.P$6
V_STEP
  Bottom 1.778: X1.2 106.68,63.5 107.95,64.77 107.95,69.85 105.41,72.39 97.79,72.39 95.25,74.93 95.25,76.2 93.98,77.47 57.15,77.47 | 57.15,77.47 54.61,74.93 A4988_2.16 54.61,66.04 53.34,64.77 46.48,64.77 C2.+ | 57.15,77.47 20.32,77.47 19.05,76.2 A4988_1.16 19.05,66.04 17.78,64.77 12.19,64.77 C1.+